# Altium schematic sheet VIDEO.SchDoc: VIDEO
size A3; Author: Silvio Navaretti; CompanyName: ARDUINO; DrawnBy: Silvio Navaretti; Engineer: Silvio Navaretti; Organization: ARDUINO; SheetNumber: 41; SheetTotal: 51; RevAuthor: Silvio Navaretti
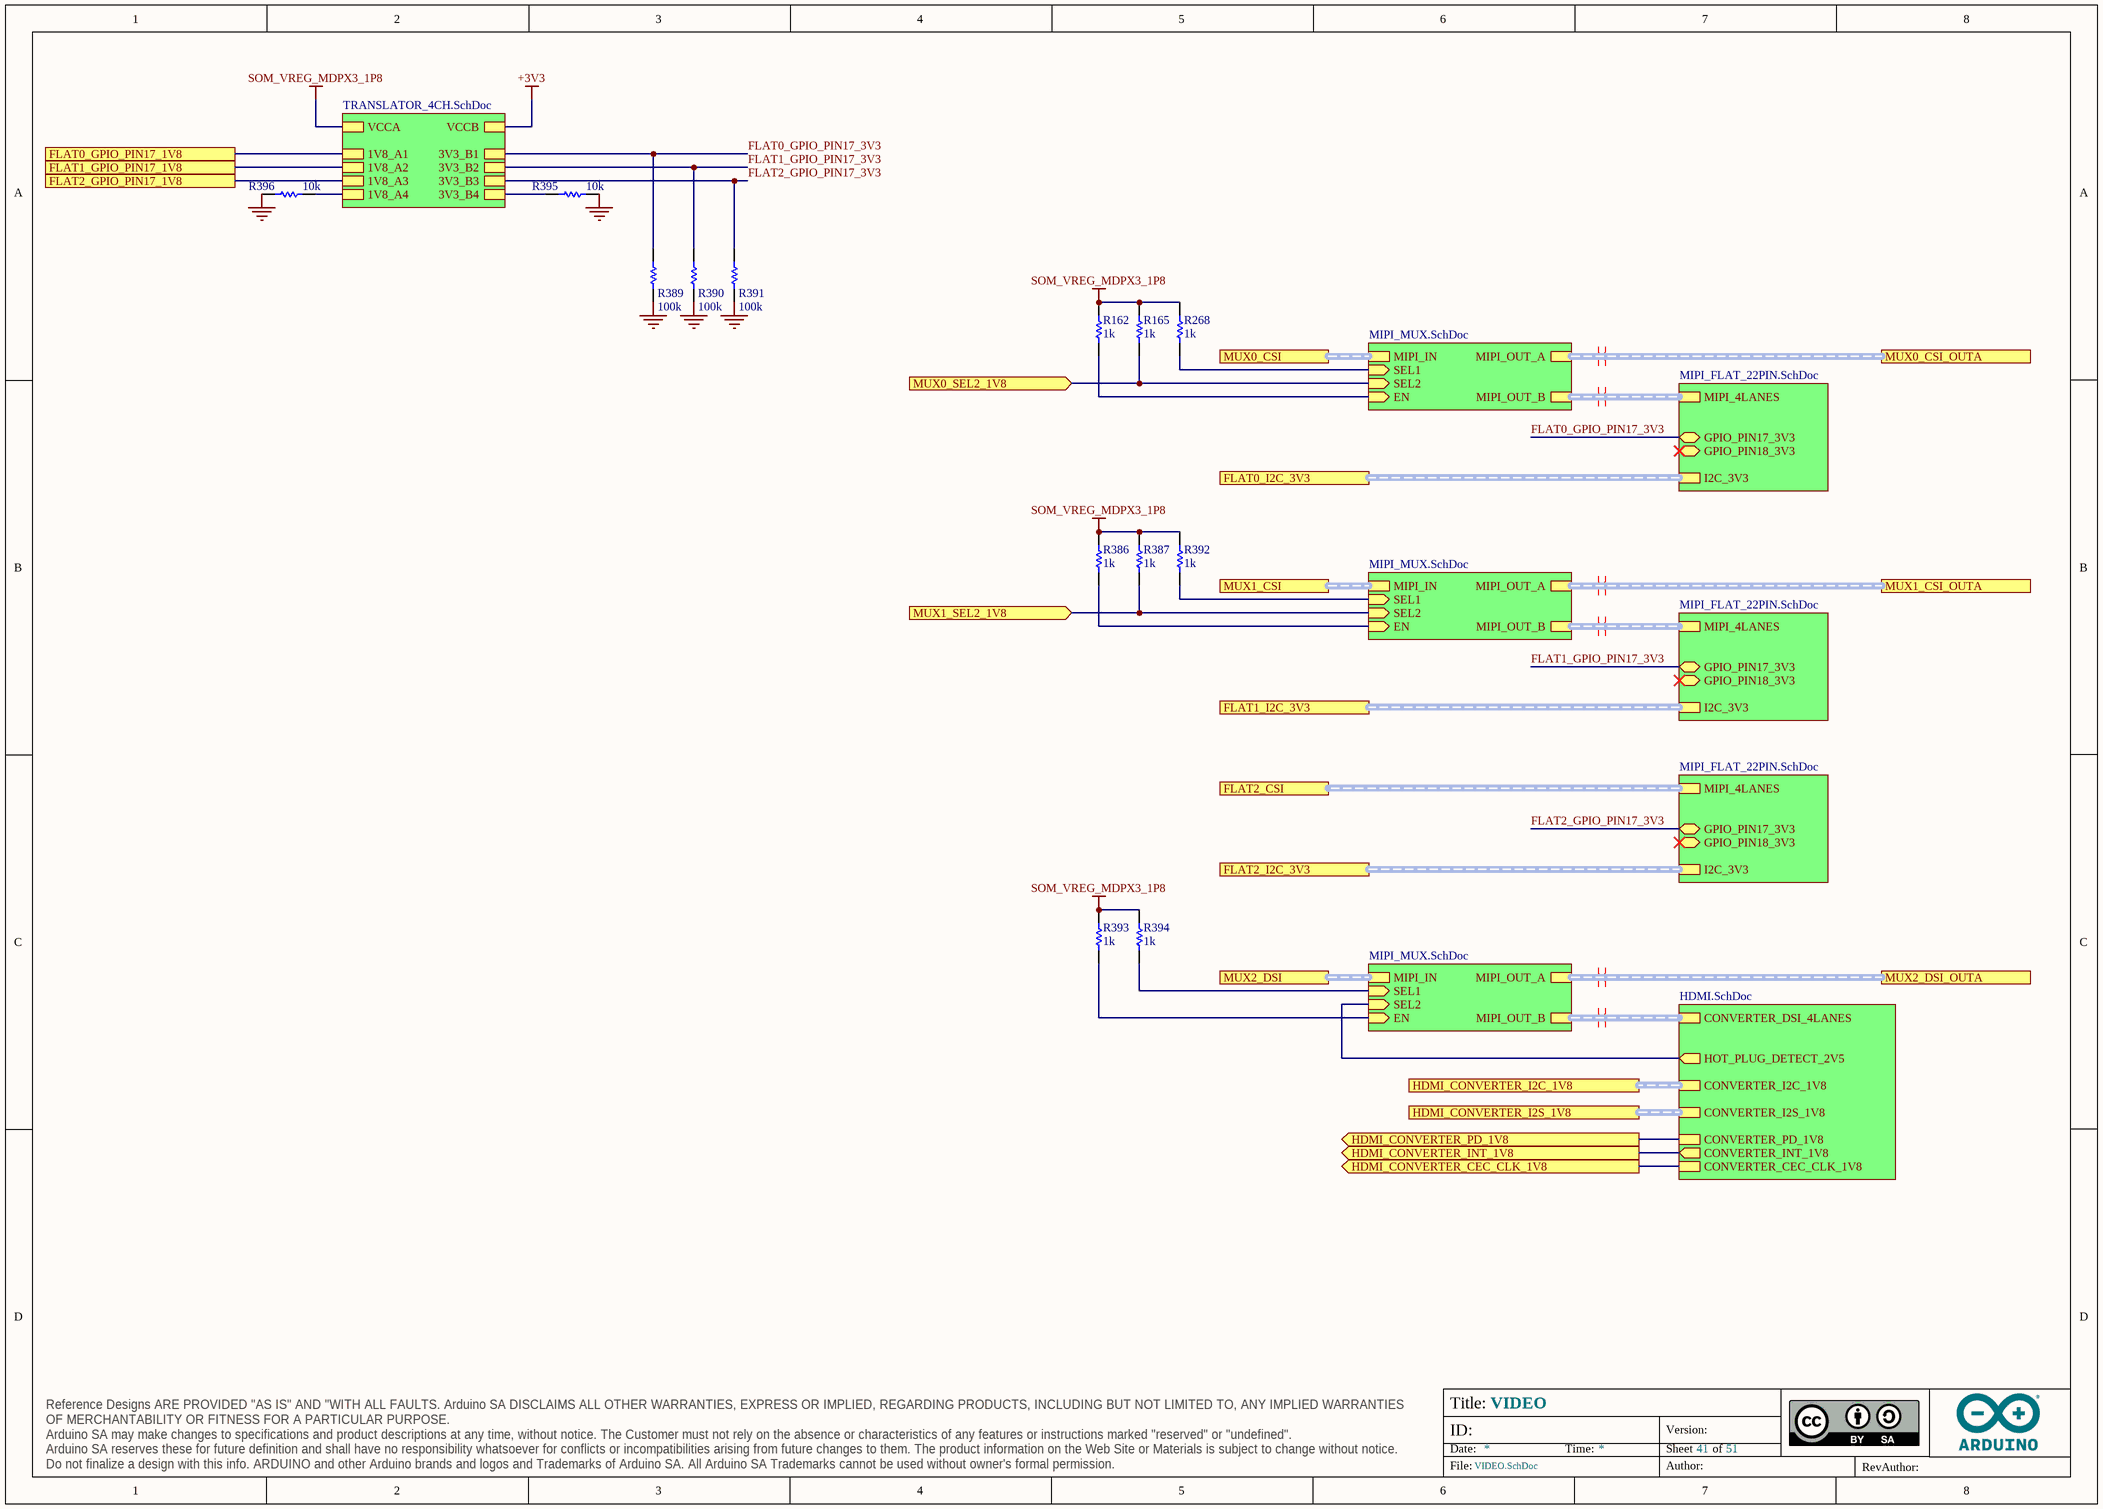
[diagram p0: VIDEO.SchDoc]

## Parts
R162  value 1k  [RES-0201]  (hidden comment: RC0201FR-071KL)
R165  value 1k  [RES-0201]  (hidden comment: RC0201FR-071KL)
R268  value 1k  [RES-0201]  (hidden comment: RC0201FR-071KL)
R386  value 1k  [RES-0201]  (hidden comment: RC0201FR-071KL)
R387  value 1k  [RES-0201]  (hidden comment: RC0201FR-071KL)
R389  value 100k  [RES-0201]  (hidden comment: RC0201FR-07100KL)
R390  value 100k  [RES-0201]  (hidden comment: RC0201FR-07100KL)
R391  value 100k  [RES-0201]  (hidden comment: RC0201FR-07100KL)
R392  value 1k  [RES-0201]  (hidden comment: RC0201FR-071KL)
R393  value 1k  [RES-0201]  (hidden comment: RC0201FR-071KL)
R394  value 1k  [RES-0201]  (hidden comment: RC0201FR-071KL)
R395  value 10k  [RES-0201]  (hidden comment: RC0201FR-0710KL)
R396  value 10k  [RES-0201]  (hidden comment: RC0201FR-0710KL)

## Sub-sheets
U_HDMI = HDMI.SchDoc: HOT_PLUG_DETECT_2V5 (out), CONVERTER_DSI_4LANES (harness MIPI_4LANES), CONVERTER_I2S_1V8 (harness MIPI_4LANES), CONVERTER_PD_1V8, CONVERTER_INT_1V8 (out), CONVERTER_CEC_CLK_1V8, CONVERTER_I2C_1V8 (harness MIPI_4LANES)
U_MIPI_FLAT_22PIN = MIPI_FLAT_22PIN.SchDoc: MIPI_4LANES (harness MIPI_4LANES), I2C_3V3 (harness I2C), GPIO_PIN17_3V3 (bidir), GPIO_PIN18_3V3 (bidir)
U_MIPI_FLAT_22PIN = MIPI_FLAT_22PIN.SchDoc: MIPI_4LANES (harness MIPI_4LANES), I2C_3V3 (harness I2C), GPIO_PIN17_3V3 (bidir), GPIO_PIN18_3V3 (bidir)
U_MIPI_FLAT_22PIN = MIPI_FLAT_22PIN.SchDoc: MIPI_4LANES (harness MIPI_4LANES), I2C_3V3 (harness I2C), GPIO_PIN17_3V3 (bidir), GPIO_PIN18_3V3 (bidir)
U_MIPI_MUX = MIPI_MUX.SchDoc: MIPI_OUT_A (harness MIPI_4LANES), MIPI_OUT_B (harness MIPI_4LANES), MIPI_IN (harness MIPI_4LANES), EN (in), SEL1 (in), SEL2 (in)
U_MIPI_MUX = MIPI_MUX.SchDoc: MIPI_IN (harness MIPI_4LANES), MIPI_OUT_A (harness MIPI_4LANES), MIPI_OUT_B (harness MIPI_4LANES), EN (in), SEL1 (in), SEL2 (in)
U_MIPI_MUX = MIPI_MUX.SchDoc: MIPI_IN (harness MIPI_4LANES), MIPI_OUT_A (harness MIPI_4LANES), MIPI_OUT_B (harness MIPI_4LANES), EN (in), SEL1 (in), SEL2 (in)
U_TRANSLATOR_4CH = TRANSLATOR_4CH.SchDoc: 1V8_A1, 1V8_A2, 1V8_A3, 1V8_A4, 3V3_B1, 3V3_B2, 3V3_B3, 3V3_B4, VCCA, VCCB

## Ports
FLAT0_GPIO_PIN17_1V8, FLAT0_I2C_3V3, FLAT1_GPIO_PIN17_1V8, FLAT1_I2C_3V3, FLAT2_CSI, FLAT2_GPIO_PIN17_1V8, FLAT2_I2C_3V3, HDMI_CONVERTER_CEC_CLK_1V8 (out), HDMI_CONVERTER_I2C_1V8 (harness I2C), HDMI_CONVERTER_I2S_1V8 (harness I2C), HDMI_CONVERTER_INT_1V8 (out), HDMI_CONVERTER_PD_1V8 (out), MUX0_CSI, MUX0_CSI_OUTA, MUX0_SEL2_1V8 (in), MUX1_CSI, MUX1_CSI_OUTA, MUX1_SEL2_1V8 (in), MUX2_DSI, MUX2_DSI_OUTA

## Nets
+3V3: sheet U_TRANSLATOR_4CH/VCCB
GND: R389.2 R390.2 R391.2 R395.2 R396.1
SOM_VREG_MDPX3_1P8: R162.1 R165.2 R268.2 R386.1 R387.2 R392.2 R393.2 R394.2 ; sheet U_TRANSLATOR_4CH/VCCA
FLAT0_GPIO_PIN17_1V8: port FLAT0_GPIO_PIN17_1V8, sheet U_TRANSLATOR_4CH/1V8_A1
FLAT0_GPIO_PIN17_3V3: R389.1 ; sheet U_MIPI_FLAT_22PIN/GPIO_PIN17_3V3, sheet U_TRANSLATOR_4CH/3V3_B1
FLAT1_GPIO_PIN17_1V8: port FLAT1_GPIO_PIN17_1V8, sheet U_TRANSLATOR_4CH/1V8_A2
FLAT1_GPIO_PIN17_3V3: R390.1 ; sheet U_MIPI_FLAT_22PIN/GPIO_PIN17_3V3, sheet U_TRANSLATOR_4CH/3V3_B2
FLAT2_GPIO_PIN17_1V8: port FLAT2_GPIO_PIN17_1V8, sheet U_TRANSLATOR_4CH/1V8_A3
FLAT2_GPIO_PIN17_3V3: R391.1 ; sheet U_MIPI_FLAT_22PIN/GPIO_PIN17_3V3, sheet U_TRANSLATOR_4CH/3V3_B3
HDMI_CONVERTER_CEC_CLK_1V8: port HDMI_CONVERTER_CEC_CLK_1V8, sheet U_HDMI/CONVERTER_CEC_CLK_1V8
HDMI_CONVERTER_INT_1V8: port HDMI_CONVERTER_INT_1V8, sheet U_HDMI/CONVERTER_INT_1V8
HDMI_CONVERTER_PD_1V8: port HDMI_CONVERTER_PD_1V8, sheet U_HDMI/CONVERTER_PD_1V8
MUX0_SEL2_1V8: R165.1 ; port MUX0_SEL2_1V8, sheet U_MIPI_MUX/SEL2
MUX1_SEL2_1V8: R387.1 ; port MUX1_SEL2_1V8, sheet U_MIPI_MUX/SEL2
NetR162_2: R162.2 ; sheet U_MIPI_MUX/EN
NetR268_1: R268.1 ; sheet U_MIPI_MUX/SEL1
NetR386_2: R386.2 ; sheet U_MIPI_MUX/EN
NetR392_1: R392.1 ; sheet U_MIPI_MUX/SEL1
NetR393_1: R393.1 ; sheet U_MIPI_MUX/EN
NetR394_1: R394.1 ; sheet U_MIPI_MUX/SEL1
NetR395_1: R395.1 ; sheet U_TRANSLATOR_4CH/3V3_B4
NetR396_2: R396.2 ; sheet U_TRANSLATOR_4CH/1V8_A4
(unnamed): sheet U_HDMI/HOT_PLUG_DETECT_2V5, sheet U_MIPI_MUX/SEL2

## Buses and harness runs
harness port FLAT0_I2C_3V3 = sheet U_MIPI_FLAT_22PIN/I2C_3V3
harness port FLAT1_I2C_3V3 = sheet U_MIPI_FLAT_22PIN/I2C_3V3
harness port FLAT2_CSI = sheet U_MIPI_FLAT_22PIN/MIPI_4LANES
harness port FLAT2_I2C_3V3 = sheet U_MIPI_FLAT_22PIN/I2C_3V3
harness port HDMI_CONVERTER_I2C_1V8 = sheet U_HDMI/CONVERTER_I2C_1V8
harness port HDMI_CONVERTER_I2S_1V8 = sheet U_HDMI/CONVERTER_I2S_1V8
harness port MUX0_CSI = sheet U_MIPI_MUX/MIPI_IN
harness port MUX0_CSI_OUTA = sheet U_MIPI_MUX/MIPI_OUT_A
harness port MUX1_CSI = sheet U_MIPI_MUX/MIPI_IN
harness port MUX1_CSI_OUTA = sheet U_MIPI_MUX/MIPI_OUT_A
harness port MUX2_DSI = sheet U_MIPI_MUX/MIPI_IN
harness port MUX2_DSI_OUTA = sheet U_MIPI_MUX/MIPI_OUT_A
harness sheet U_HDMI/CONVERTER_DSI_4LANES = sheet U_MIPI_MUX/MIPI_OUT_B
harness sheet U_MIPI_FLAT_22PIN/MIPI_4LANES = sheet U_MIPI_MUX/MIPI_OUT_B

## Layout directives
differential pair; differential pair class DIFF_MUX0_OUTA; net class NET_DIFF_CSI_DSI: (no net found under the mark)
differential pair; differential pair class DIFF_MUX0_OUTB; net class NET_DIFF_CSI_DSI: (no net found under the mark)
differential pair; differential pair class DIFF_MUX1_OUTA; net class NET_DIFF_CSI_DSI: (no net found under the mark)
differential pair; differential pair class DIFF_MUX1_OUTB; net class NET_DIFF_CSI_DSI: (no net found under the mark)
differential pair; differential pair class DIFF_MUX2_OUTB; net class NET_DIFF_CSI_DSI: (no net found under the mark)
differential pair; differential pair class DIFF_MUX2_OUTA; net class NET_DIFF_CSI_DSI: (no net found under the mark)

## Notes on the sheet
- Title:
- ID:
- Date:
- Time:
- Version:
- Sheet
- of
- RevAuthor:
- Reference Designs ARE PROVIDED "AS IS" AND "WITH ALL FAULTS. Arduino SA DISCLAIMS ALL OTHER WARRANTIES, EXPRESS OR IMPLIED, REGARDING PRODUCTS, INCLUDING BUT NOT LIMITED TO, ANY IMPLIED WARRANTIES OF MERCHANTABILITY OR FITNESS FOR A PARTICULAR PURPOSE.
  Arduino SA may make changes to specifications and product descriptions at any time, without notice. The Customer must not rely on the absence or characteristics of any features or instructions marked "reserved" or "undefined".
  Arduino SA reserves these for future definition and shall have no responsibility whatsoever for conflicts or incompatibilities arising from future changes to them. The product information on the Web Site or Materials is subject to change without notice.
  Do not finalize a design with this info. ARDUINO and other Arduino brands and logos and Trademarks of Arduino SA. All Arduino SA Trademarks cannot be used without owner's formal permission.
- File:
- Author:

## Library data of the parts
R162 R165 R268 R386 R387 R392-R394 = R0195-A.22: RES CHIP 0201 1k 1% 1/20W; Manufacturer: Yageo; Power: 50mW; Temperature coefficient: 200ppm; Code Arduino: R0195; Tolerance: 1%; Case Code (Imperial): 0201; Part Number: RC0201FR-071KL; Technology: Thick film
R389-R391 = R0146-A.21: RES CHIP 0201 100k 1% 1/20W; Manufacturer: Yageo; Power: 50mW; Temperature coefficient: 200ppm; Code Arduino: R0146; Manufacturer 2: Samsung Electro-Mechanics; Tolerance: 1%; Case Code (Imperial): 0201; Part Number: RC0201FR-07100KL; Technology: Thick film
R395 R396 = R0145-A.21: RES CHIP 0201 10k 1% 1/20W; Manufacturer: Yageo; Power: 50mW; Temperature coefficient: 200ppm; Code Arduino: R0145; Manufacturer 2: Samsung Electro-Mechanics; Tolerance: 1%; Case Code (Imperial): 0201; Part Number: RC0201FR-0710KL; Technology: Thick film